# EAGLE schematic Dosringspumpestyring (EAGLE 7.2.0)
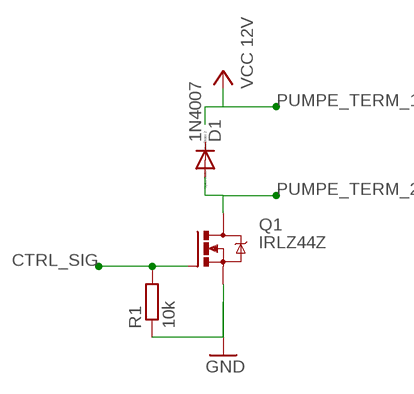
[diagram p0: schematic, sheet 1]

## Parts
D1  1N4007  1N4004  [DO41-10]
Q1  IRLZ44Z  [TO220BH]
R1  10k  R-EU_0204/2V  [0204V]

## Nets
CTRL_SIG: Q1.G R1.2
GND: Q1.S R1.1
PUMPE_TERM_2: D1.A Q1.D
Unconnected: D1.C

## Library data of the parts
D1 = diode:1N4004: DIODE general purpose rectifier, 1 A
Q1 = transistor-power:IRLZ44Z: N-Channel HEXFET® Power MOSFET Logic Level AUTOMOTIVE MOSFET Source: http://www.irf.com/product-info/datasheets/data/irlz44zpbf.pdf
R1 = resistor:R-EU_: RESISTOR, European symbol